# Altium schematic sheet PowerSupplies.SchDoc
size A4; SheetNumber: 1; SheetTotal: 10
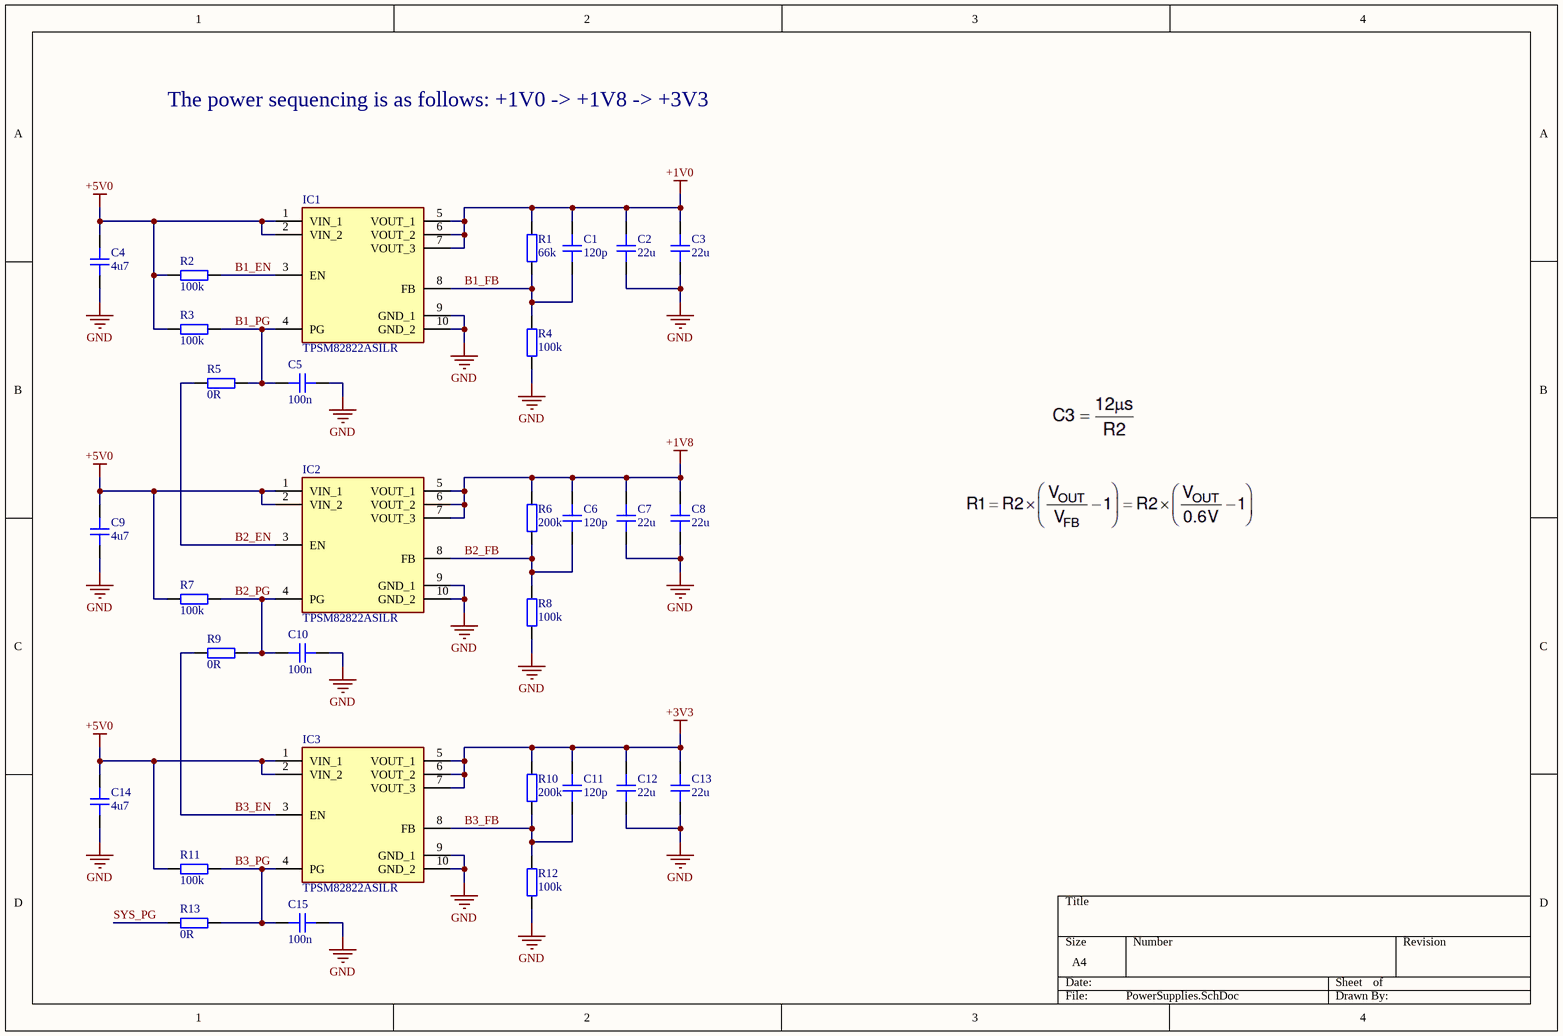
[diagram p0: PowerSupplies.SchDoc]

## Parts
C1  120p  [CAP_0402]
C2  22u  [CAP_0603]
C3  22u  [CAP_0603]
C4  4u7  [CAP_0402]
C5  100n  [CAP_0402]
C6  120p  [CAP_0402]
C7  22u  [CAP_0603]
C8  22u  [CAP_0603]
C9  4u7  [CAP_0402]
C10  100n  [CAP_0402]
C11  120p  [CAP_0402]
C12  22u  [CAP_0603]
C13  22u  [CAP_0603]
C14  4u7  [CAP_0402]
C15  100n  [CAP_0402]
IC1  TPSM82822ASILR  [TPSM82822ASILR]
IC2  TPSM82822ASILR  [TPSM82822ASILR]
IC3  TPSM82822ASILR  [TPSM82822ASILR]
R1  66k  [RES_0402]
R2  100k  [RES_0402]
R3  100k  [RES_0402]
R4  100k  [RES_0402]
R5  0R  [RES_0402]
R6  200k  [RES_0402]
R7  100k  [RES_0402]
R8  100k  [RES_0402]
R9  0R  [RES_0402]
R10  200k  [RES_0402]
R11  100k  [RES_0402]
R12  100k  [RES_0402]
R13  0R  [RES_0402]

## Nets
+1V0: C1.2 C2.2 C3.2 IC1.5(VOUT_1) IC1.6(VOUT_2) IC1.7(VOUT_3) R1.2
+1V8: C6.2 C7.2 C8.2 IC2.5(VOUT_1) IC2.6(VOUT_2) IC2.7(VOUT_3) R6.2
+3V3: C11.2 C12.2 C13.2 IC3.5(VOUT_1) IC3.6(VOUT_2) IC3.7(VOUT_3) R10.2
+5V0: C4.2 C9.2 C14.2 IC1.1(VIN_1) IC1.2(VIN_2) IC2.1(VIN_1) IC2.2(VIN_2) IC3.1(VIN_1) IC3.2(VIN_2) R2.1 R3.1 R7.1 R11.1
GND: C2.1 C3.1 C4.1 C5.1 C7.1 C8.1 C9.1 C10.1 C12.1 C13.1 C14.1 C15.1 IC1.9(GND_1) IC1.10(GND_2) IC2.9(GND_1) IC2.10(GND_2) IC3.9(GND_1) IC3.10(GND_2) R4.1 R8.1 R12.1
B1_EN: IC1.3(EN) R2.2
B1_FB: C1.1 IC1.8(FB) R1.1 R4.2
B1_PG: C5.2 IC1.4(PG) R3.2 R5.2
B2_EN: IC2.3(EN) R5.1
B2_FB: C6.1 IC2.8(FB) R6.1 R8.2
B2_PG: C10.2 IC2.4(PG) R7.2 R9.2
B3_EN: IC3.3(EN) R9.1
B3_FB: C11.1 IC3.8(FB) R10.1 R12.2
B3_PG: C15.2 IC3.4(PG) R11.2 R13.2
SYS_PG: R13.1

## Notes on the sheet
- The power sequencing is as follows: +1V0 -> +1V8 -> +3V3

## Library data of the parts
C1 C4-C6 C9-C11 C14 C15 = CAP_0402: Capacitor SMD 0402; Manufacturer: *; Manufacturer Part Number: *; Distributor Link: *; LCSC: *; Rating: *; Dielectric: *
C2 C3 C7 C8 C12 C13 = CAP_0603: Capacitor SMD 0603; Manufacturer: *; Manufacturer Part Number: *; Distributor Link: *; LCSC: *; Rating: *; Dielectric: *
IC1-IC3 = TPSM82822ASILR: Integrated Circuit; Manufacturer_Name: Texas Instruments; Datasheet Link: https://www.ti.com/lit/ds/symlink/tpsm82821a.pdf?ts=1639463145334&ref_url=https%253A%252F%252Fwww.ti.com%252Fsitesearch%252Fdocs%252Funiversalsearch.tsp%253FlangPref%253Den-US%2526searchTerm%253DTPSM82821ASILR%2526nr%253D8; Height: 1.1mm; Manufacturer_Part_Number: TPSM82822ASILR; Mouser Part Number: 595-TPSM82822ASILR; Mouser Price/Stock: https://www.mouser.co.uk/ProductDetail/Texas-Instruments/TPSM82822ASILR?qs=Rp5uXu7WBW%252BPqUf1%252BNZZyw%3D%3D; Arrow Part Number: TPSM82822ASILR; Arrow Price/Stock: https://www.arrow.com/en/products/tpsm82822asilr/texas-instruments?region=nac
R1-R13 = RES_0402: Resistor SMD 0402; Manufacturer: *; Manufacturer Part Number: *; Distributor Link: *; LCSC: *